# Altium schematic sheet FU-AM-FU6861Q-B-002-HW-V3.0-20200620.SchDoc
size A3; SheetNumber: 0; SheetTotal: 0
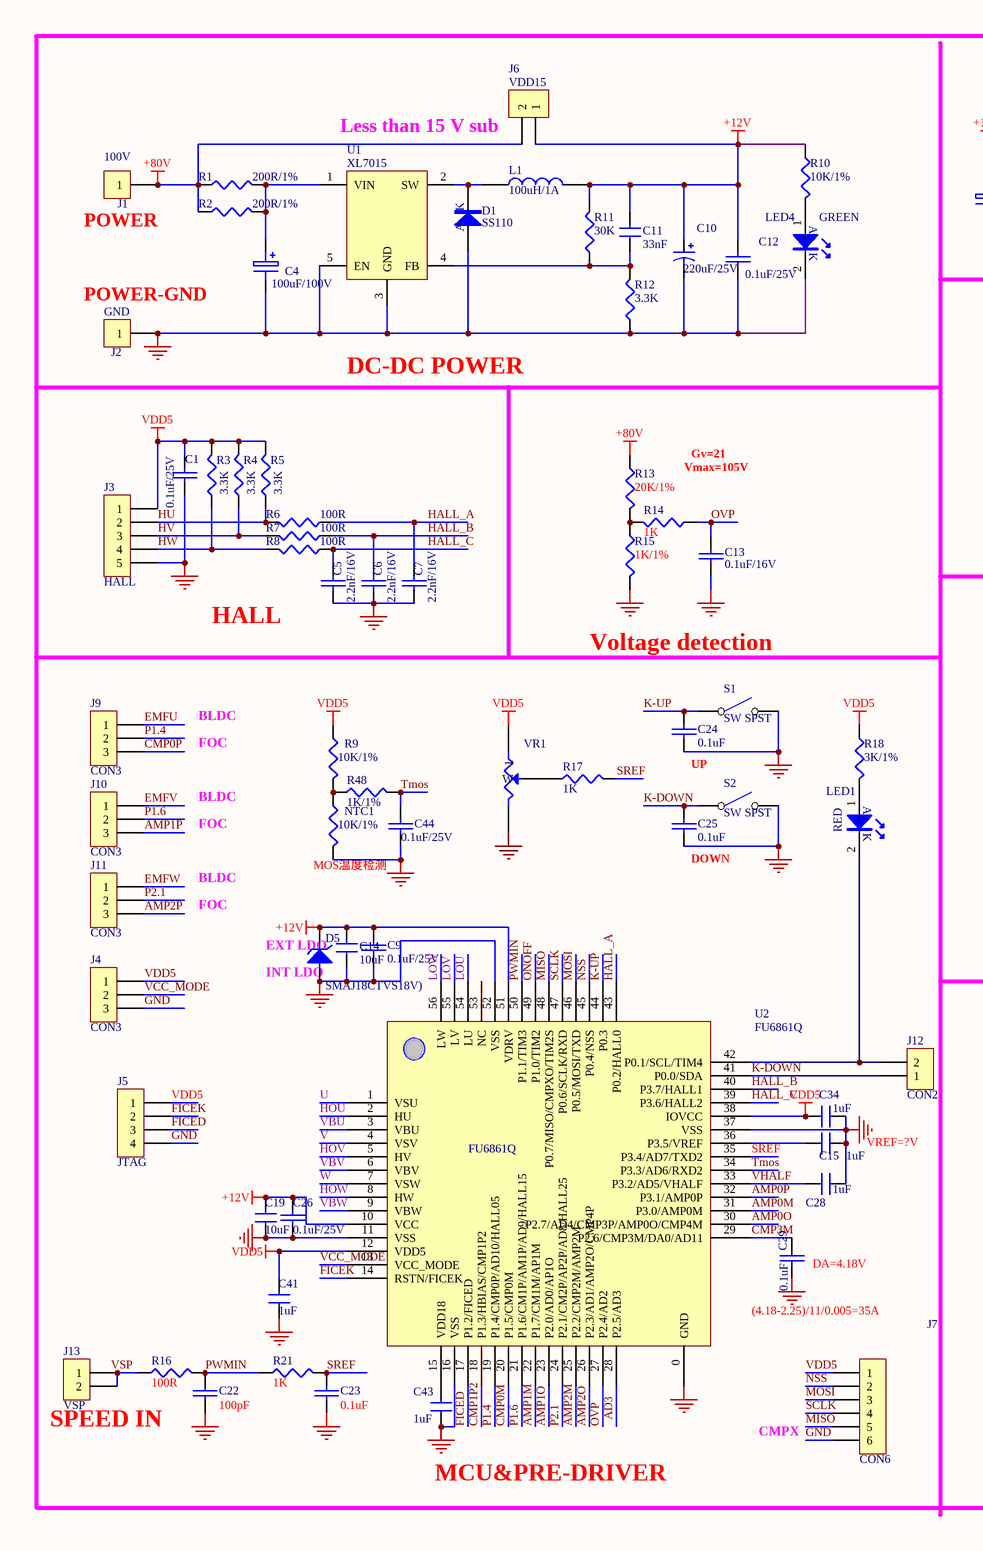
[diagram p0: FU-AM-FU6861Q-B-002-HW-V3.0-20200620.SchDoc, left]
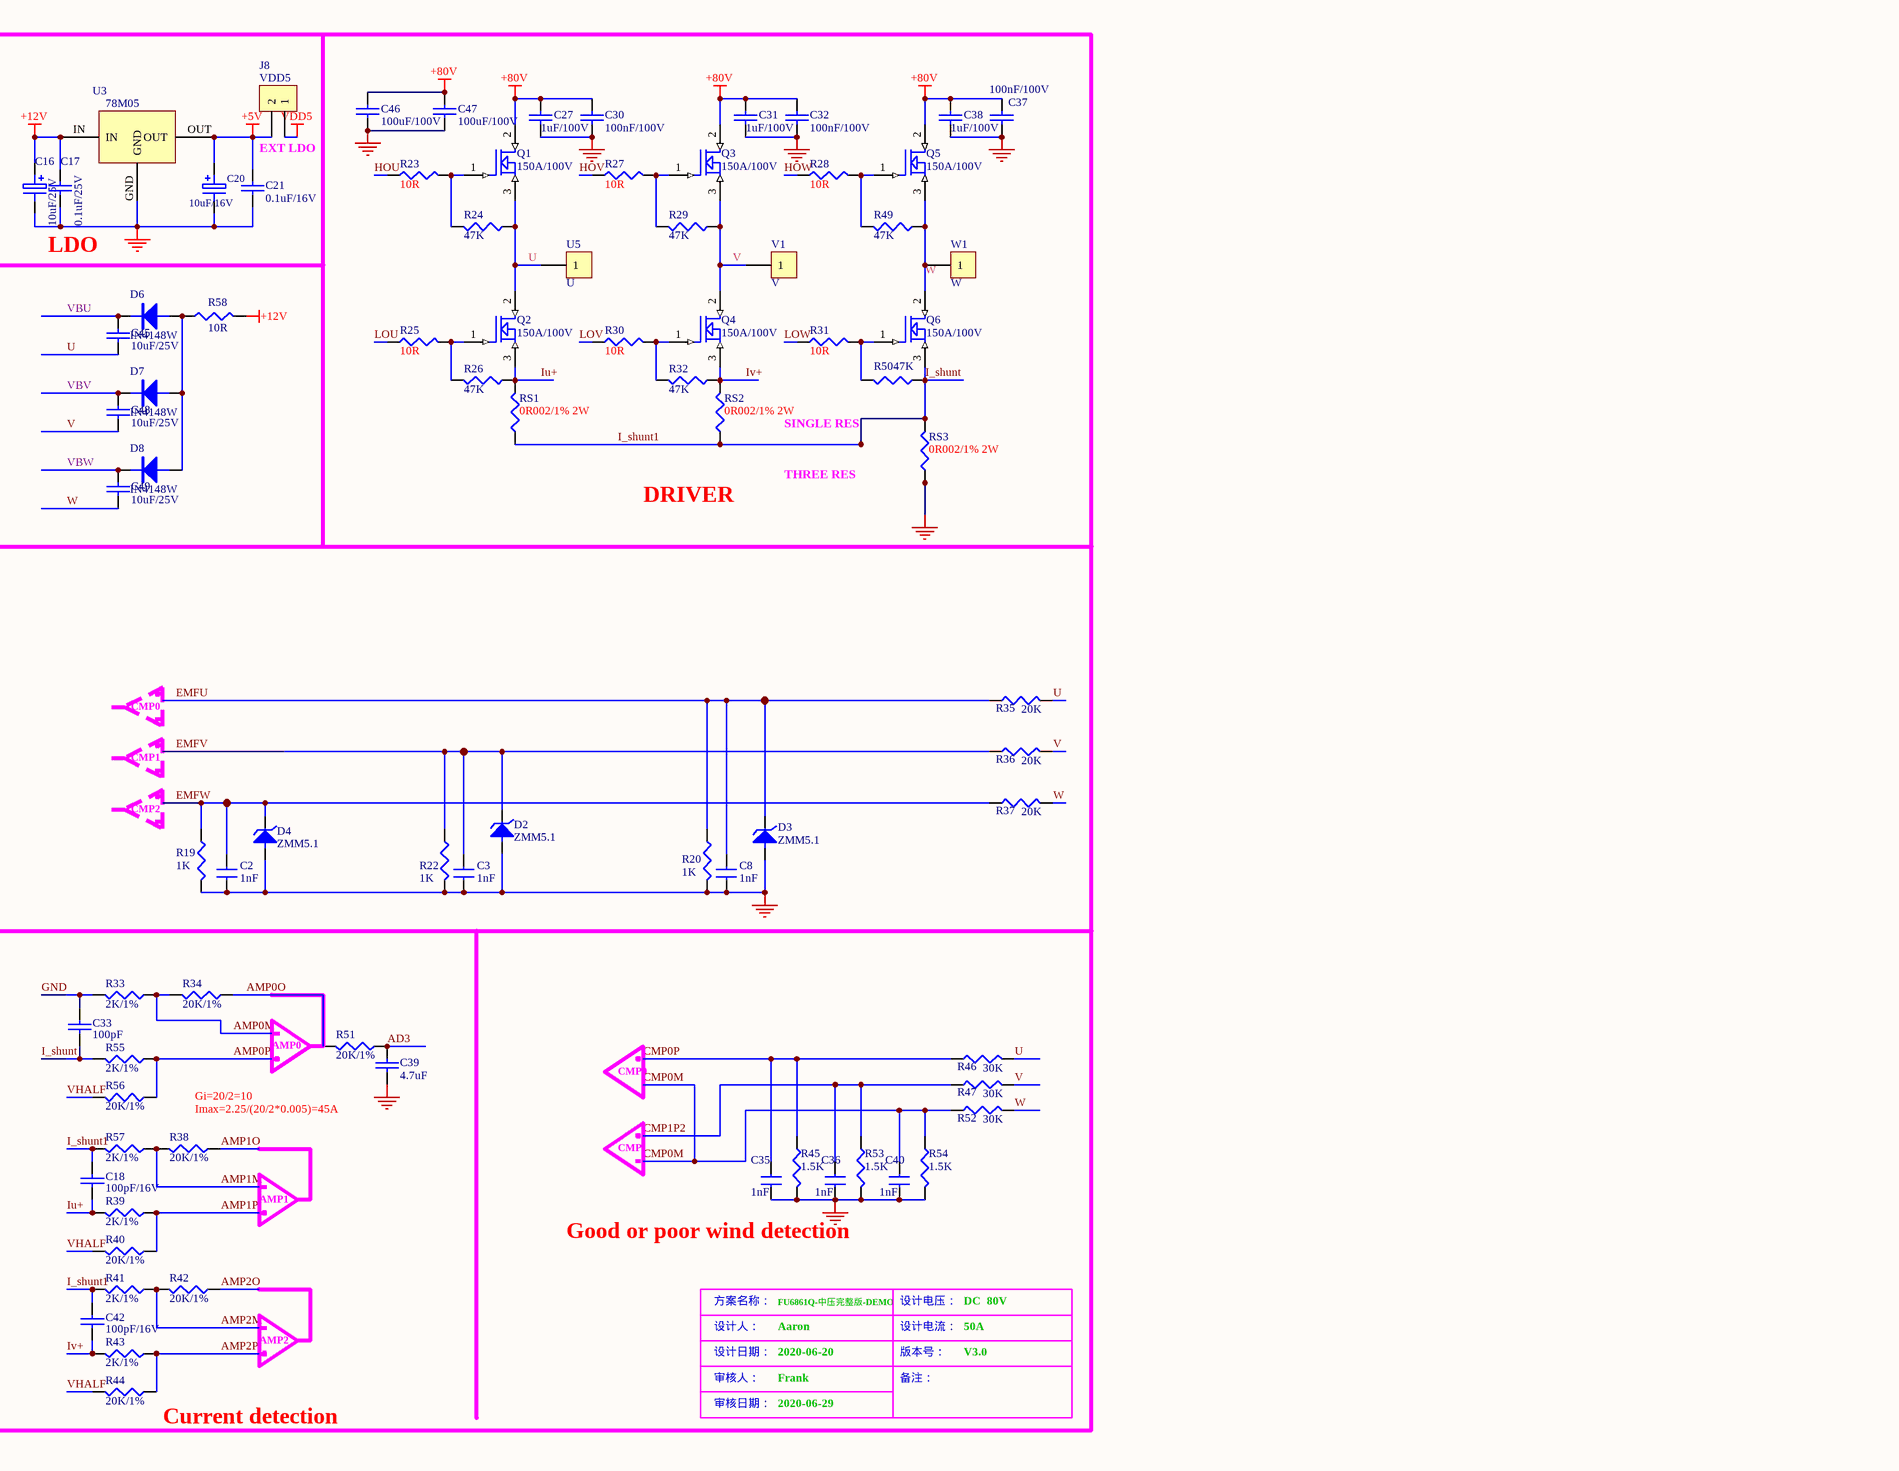
[diagram p1: FU-AM-FU6861Q-B-002-HW-V3.0-20200620.SchDoc, right]

## Parts
C1  0.1uF/25V  [C0805]
C2  1nF  [C0805]
C3  1nF  [C0805]
C4  100uF/100V  [CE5-10/16]
C5  2.2nF/16V  [C0805]
C6  2.2nF/16V  [C0805]
C7  2.2nF/16V  [C0805]
C8  1nF  [C0805]
C9  0.1uF/25V  [C0805]
C10  220uF/25V  [CE3.5-8/12]
C11  33nF  [C0805]
C12  0.1uF/25V  [C0805]
C13  0.1uF/16V  [C0805]
C14  10uF  [C0805]
C15  1uF  [C0805]
C16  10uF/25V  [C1206]
C17  0.1uF/25V  [C0805]
C18  100pF/16V  [C0805]
C19  10uF  [C0805]
C20  10uF/16V  [C1206]
C21  0.1uF/16V  [C0805]
C22  100pF  [C0805]
C23  0.1uF  [C0805]
C24  0.1uF  [C0805]
C25  0.1uF  [C0805]
C26  0.1uF/25V  [C0805]
C27  1uF/100V  [C1206]
C28  1uF  [C0805]
C29  0.1uF  [C0805]
C30  100nF/100V  [C1206]
C31  1uF/100V  [C1206]
C32  100nF/100V  [C1206]
C33  100pF  [C0805]
C34  1uF  [C0805]
C35  1nF  [C0805]
C36  1nF  [C0805]
C37  100nF/100V  [C1206]
C38  1uF/100V  [C1206]
C39  4.7uF  [C0805]
C40  1nF  [C0805]
C41  1uF  [C0805]
C42  100pF/16V  [C0805]
C43  1uF  [C0805]
C44  0.1uF/25V  [C0805]
C45  10uF/25V  [C0805]
C46  100uF/100V  [CE7.5-16/25]
C47  100uF/100V  [CE7.5-16/25]
C48  10uF/25V  [C0805]
C49  10uF/25V  [C0805]
D1  SS110  [SMA]
D2  ZMM5.1  [SOD-123]
D3  ZMM5.1  [SOD-123]
D4  ZMM5.1  [SOD-123]
D5  SMAJ18CTVS18V)  [SMA]
D6  IN4148W  [SOD-123]
D7  IN4148W  [SOD-123]
D8  IN4148W  [SOD-123]
J1  100V  [TP]
J2  GND  [TP]
J3  HALL  [XH-5P-2.54]
J4  CON3  [SIP3-2.54]
J5  JTAG  [SIP4-2.54]
J6  VDD15  [SIP2-2.54]
J7  CON6  [sip6-2.54]
J8  VDD5  [SIP2-2.54]
J9  CON3  [SIP3-2.54]
J10  CON3  [SIP3-2.54]
J11  CON3  [SIP3-2.54]
J12  CON2  [SIP2-2.54]
J13  VSP  [SIP2-2.54]
L1  100uH/1A  [L4.5-9]
LED1  RED  [LED0805]
LED4  GREEN  [LED0805]
NTC1  10K/1%  [R0805]
Q1  150A/100V  [TO-220AB-W]
Q2  150A/100V  [TO-220AB-W]
Q3  150A/100V  [TO-220AB-W]
Q4  150A/100V  [TO-220AB-W]
Q5  150A/100V  [TO-220AB-W]
Q6  150A/100V  [TO-220AB-W]
R1  200R/1%  [R1206]
R2  200R/1%  [R1206]
R3  3.3K  [R0805]
R4  3.3K  [R0805]
R5  3.3K  [R0805]
R6  100R  [R0805]
R7  100R  [R0805]
R8  100R  [R0805]
R9  10K/1%  [R0805]
R10  10K/1%  [R0805]
R11  30K  [R0805]
R12  3.3K  [R0805]
R13  20K/1%  [R0805]
R14  1K  [R0805]
R15  1K/1%  [R0805]
R16  100R  [R0805]
R17  1K  [R0805]
R18  3K/1%  [R0805]
R19  1K  [R0805]
R20  1K  [R0805]
R21  1K  [R0805]
R22  1K  [R0805]
R23  10R  [R0805]
R24  47K  [R0805]
R25  10R  [R0805]
R26  47K  [R0805]
R27  10R  [R0805]
R28  10R  [R0805]
R29  47K  [R0805]
R30  10R  [R0805]
R31  10R  [R0805]
R32  47K  [R0805]
R33  2K/1%  [R0805]
R34  20K/1%  [R0805]
R35  20K  [R0805]
R36  20K  [R0805]
R37  20K  [R0805]
R38  20K/1%  [R0805]
R39  2K/1%  [R0805]
R40  20K/1%  [R0805]
R41  2K/1%  [R0805]
R42  20K/1%  [R0805]
R43  2K/1%  [R0805]
R44  20K/1%  [R0805]
R45  1.5K  [R0805]
R46  30K  [R0805]
R47  30K  [R0805]
R48  1K/1%  [R0805]
R49  47K  [R0805]
R50  47K  [R0805]
R51  20K/1%  [R0805]
R52  30K  [R0805]
R53  1.5K  [R0805]
R54  1.5K  [R0805]
R55  2K/1%  [R0805]
R56  20K/1%  [R0805]
R57  2K/1%  [R0805]
R58  10R  [R1206]
RS1  0R002/1% 2W  [R2512]
RS2  0R002/1% 2W  [R2512]
RS3  0R002/1% 2W  [R2512]
S1  SW SPST  [SW-6/6]
S2  SW SPST  [SW-6/6]
U1  XL7015  [TO-252-5L]
U2  FU6861Q  [QFN56]
U3  78M05  [TO-252-3L]
U5  U  [TP]
V1  V  [TP]
VR1  (no value)  [VR6]
W1  W  [TP]

## Nets
+5V: C20.1 C21.1 J8.2 U3.OUT
+12V: C9.1 C10.1 C11.1 C12.1 C14.2 C16.1 C17.1 C19.2 C26.1 D5.2(K) J6.1 L1.2 R10.1 R11.2 R58.2 U2.10(VCC) U2.51(VDRV) U3.IN
+80V: C27.1 C30.1 C31.1 C32.1 C37.1 C38.1 C46.1 C47.1 J1.1 J6.2 Q1.2(D) Q3.2(D) Q5.2(D) R1.1 R2.1 R13.1
GND: C1.1 C2.2 C3.2 C4.2 C5.1 C6.1 C7.1 C8.2 C9.2 C10.2 C12.2 C13.2 C14.1 C15.2 C16.2 C17.2 C19.1 C20.2 C21.2 C22.2 C23.2 C24.2 C25.2 C26.2 C27.2 C28.2 C29.1 C30.2 C31.2 C32.2 C33.1 C34.1 C35.2 C36.2 C37.2 C38.2 C39.2 C40.2 C41.2 C43.1 C44.2 C46.2 C47.2 D1.1 D2.1(A) D3.1(A) D4.1(A) D5.1(A) J2.1 J3.5 J4.3 J5.4 J7.6 LED4.2 NTC1.2 R12.1 R15.2 R19.2 R20.2 R22.2 R33.2 R45.2 R53.2 R54.2 RS3.1 S1.2(NO) S2.2(NO) U1.3(GND) U1.5(EN) U2.0(GND) U2.11(VSS) U2.16(VSS) U2.37(VSS) U2.52(VSS) U3.GND VR1.3
VDD5: C1.2 C34.2 C41.1 J3.1 J4.1 J5.1 J7.1 J8.1 R3.2 R4.2 R5.2 R9.1 R18.1 U2.12(VDD5) U2.38(IOVCC) VR1.1
AD3: C39.1 R51.1 U2.28(P2.5/AD3)
AMP0M: R33.1 R34.2 U2.31(P3.0/AMP0M)
AMP0O: R34.1 R51.2 U2.30(P2.7/AD4/CMP3P/AMP0O/CMP4M)
AMP0P: R55.1 R56.1 U2.32(P3.1/AMP0P)
AMP1M: R38.2 R57.1 U2.22(P1.7/CM1M/AP1M)
AMP1O: R38.1 U2.23(P2.0/AD0/AP1O)
AMP1P: J10.3 R39.1 R40.1
AMP2M: R41.1 R42.2 U2.25(P2.2/CMP2M/AMP2M)
AMP2O: R42.1 U2.26(P2.3/AD1/AMP2O/CMP4P)
AMP2P: J11.3 R43.1 R44.1
CMP0M: C40.1 R52.1 R54.1 U2.20(P1.5/CMP0M)
CMP0P: C35.1 J9.3 R45.1 R46.1
CMP1P2: C36.1 R47.1 R53.1 U2.18(P1.3/HBIAS/CMP1P2)
CMP3M: C29.2 U2.29(P2.6/CMP3M/DA0/AD11)
EMFU: C8.1 D3.2(K) J9.1 R20.1 R35.1
EMFV: C3.1 D2.2(K) J10.1 R22.1 R36.1
EMFW: C2.1 D4.2(K) J11.1 R19.1 R37.1
FICED: J5.3 U2.17(P1.2/FICED)
FICEK: J5.2 U2.14(RSTN/FICEK)
HALL_A: C7.2 R6.1 U2.43(P0.2/HALL0)
HALL_B: C6.2 R7.1 U2.40(P3.7/HALL1)
HALL_C: C5.2 R8.1 U2.39(P3.6/HALL2)
HOU: R23.1 U2.2(HU)
HOV: R27.1 U2.5(HV)
HOW: R28.1 U2.8(HW)
HU: J3.2 R5.1 R6.2
HV: J3.3 R4.1 R7.2
HW: J3.4 R3.1 R8.2
I_shunt: C18.1 C33.2 C42.1 Q6.3(S) R41.2 R50.1 R55.2 R57.2 RS1.1 RS2.1 RS3.2  [also labelled I_shunt1]
Iu+: C18.2 Q2.3(S) R26.1 R39.2 RS1.2
Iv+: C42.2 Q4.3(S) R32.1 R43.2 RS2.2
K-DOWN: C25.1 J12.1 S2.1(COMMON) U2.41(P0.0/SDA)
K-UP: C24.1 S1.1(COMMON) U2.44(P0.3)
LOU: R25.1 U2.54(LU)
LOV: R30.1 U2.55(LV)
LOW: R31.1 U2.56(LW)
MISO: J7.5 U2.48(P0.7/MISO/CMPXO/TIM2S)
MOSI: J7.3 U2.46(P0.5/MOSI/TXD)
NSS: J7.2 U2.45(P0.4/NSS)
ONOFF: U2.49(P1.0/TIM2)
OVP: C13.1 R14.1 U2.27(P2.4/AD2)
P1.4: J9.2 U2.19(P1.4/CMP0P/AD10/HALL05)
P1.6: J10.2 U2.21(P1.6/CM1P/AM1P/AD9/HALL15)
P2.1: J11.2 U2.24(P2.1/CM2P/AP2P/AD8/HALL25)
PWMIN: C22.1 R16.2 R21.1 U2.50(P1.1/TIM3)
SCLK: J7.4 U2.47(P0.6/SCLK/RXD)
SREF: C23.1 R17.2 R21.2 U2.35(P3.4/AD7/TXD2)
Tmos: C44.1 R48.2 U2.34(P3.3/AD6/RXD2)
U: C45.1 Q1.3(S) Q2.2(D) R24.1 R35.2 R46.2 U2.1(VSU) U5.1
V: C48.1 Q3.3(S) Q4.2(D) R29.1 R36.2 R47.2 U2.4(VSV) V1.1
VBU: C45.2 D6.K U2.3(VBU)
VBV: C48.2 D7.K U2.6(VBV)
VBW: C49.2 D8.K U2.9(VBW)
VCC_MODE: J4.2 U2.13(VCC_MODE)
VHALF: C28.1 R40.2 R44.2 R56.2 U2.33(P3.2/AD5/VHALF)
W: C49.1 Q5.3(S) Q6.2(D) R37.2 R49.1 R52.2 U2.7(VSW) W1.1
NetC4_1: C4.1 R1.2 R2.2 U1.1(VIN)
NetC11_2: C11.2 R11.1 R12.2 U1.4(FB)
NetC15_1: C15.1 U2.36(P3.5/VREF)
NetC43_2: C43.2 U2.15(VDD18)
NetD1_2: D1.2(K) L1.1 U1.2(SW)
NetD6_A: D6.A D7.A D8.A R58.1
NetJ12_2: J12.2 LED1.2 U2.42(P0.1/SCL/TIM4)
NetJ13_1: J13.1 J13.2 R16.1
NetLED1_1: LED1.1 R18.2
NetLED4_1: LED4.1 R10.2
NetNTC1_1: NTC1.1 R9.2 R48.1
NetQ1_1: Q1.1(G) R23.2 R24.2
NetQ2_1: Q2.1(G) R25.2 R26.2
NetQ3_1: Q3.1(G) R27.2 R29.2
NetQ4_1: Q4.1(G) R30.2 R32.2
NetQ5_1: Q5.1(G) R28.2 R49.2
NetQ6_1: Q6.1(G) R31.2 R50.2
NetR13_2: R13.2 R14.2 R15.1
NetR17_1: R17.1 VR1.W

Not connected (* = marked no-connect by the designer): U2 53(NC)

## Notes on the sheet
- (near J6) Less than 15 V sub
- EXT LDO
- (near J1) POWER
- (near J2) POWER-GND
- LDO
- DC-DC POWER
- Vmax=105V
- Gv=21
- SINGLE RES
- DRIVER
- THREE RES
- HALL
- Voltage detection
- BLDC
- FOC
- (near C24) UP
- CMP0
- CMP1
- (near NTC1) MOS温度检测
- (near C25) DOWN
- CMP2
- (near D5) EXT LDO
- (near D5) INT LDO
- VREF=?V
- (near R51) AMP0
- Gi=20/2=10
- Imax=2.25/(20/2*0.005)=45A
- (near C29) DA=4.18V
- AMP1
- (4.18-2.25)/11/0.005=35A
- Good or poor wind detection
- AMP2
- 方案名称：
- 设计人：
- FU6861Q-中压完整版-DEMO
- Aaron
- 设计电压：
- 设计电流：
- DC  80V
- 50A
- SPEED IN
- CMPX
- 设计日期：
- 审核人：
- 2020-06-20
- Frank
- 版本号：
- 备注：
- V3.0
- (near C43) MCU&PRE-DRIVER
- (near R44) Current detection
- 审核日期：
- 2020-06-29
- Labels drawn without touching a wire or pin: VSP
- (in symbol DIODE) A
- (in symbol LED) A; K

## Library data of the parts
C1-C3 C5-C8 C11-C15 C17-C19 C24 C25 C27-C43 C46 C47 = CAP: Capacitor
C4 C16 = ELECTRO1: Electrolytic Capacitor
C9 C22 C23 C26 C44 = CAP-CC: Capacitor
C10 = Cap Pol1: Polarized Capacitor (Radial); Published: *; LatestRevisionDate: *; LatestRevisionNote: *; PackageReference: *; Publisher: *; Value: *
C20 = ELECTRO1
C21 C45 C48 C49 = CAP-CC(SMD): Capacitor
D1 = DIODE
D2-D4 = ZENER3: Zener Diode
D5 = TVS1: Zener Diode
D6-D8 = 1N4004: Diode
J1 J2 U5 V1 W1 = CON1: Connector
J3 = CON5: Connector
J4 J9-J11 = CON3: Connector
J5 = CON4: Connector
J6 J8 J12 J13 = CON2: Connector
J7 = CON6: Connector
L1 = INDUCTOR
LED1 LED4 = LED
NTC1 R1-R18 R21 R23-R34 R38-R44 R48-R51 R55-R58 RS1-RS3 = RES(SMD)
Q1-Q6 = MOSFET N(GDS)
R19 R20 R22 R35-R37 R45-R47 R52-R54 = RES-SMD: RES
VR1 = RV-3296: Potentiometer